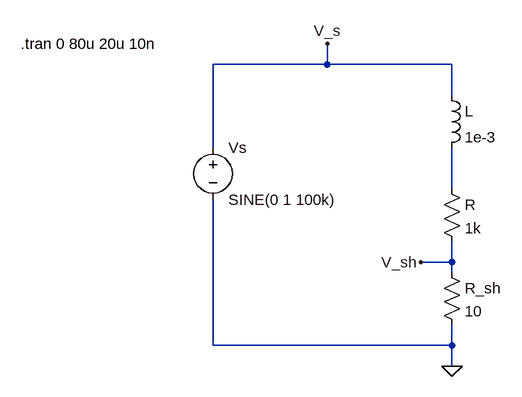
[diagram p0: schematic Simulacao1.asc]
Simulacao1.asc, the LTspice schematic file:
Version 4
SHEET 1 880 680
WIRE -32 -96 -32 -128
WIRE -32 -96 -208 -96
WIRE 160 -96 -32 -96
WIRE 160 -48 160 -96
WIRE -208 32 -208 -96
WIRE 160 96 160 32
WIRE 160 208 160 176
WIRE 160 208 112 208
WIRE 160 224 160 208
WIRE -208 336 -208 112
WIRE 160 336 160 304
WIRE 160 336 -208 336
WIRE 160 368 160 336
FLAG 160 368 0
FLAG 112 208 V_sh
FLAG -32 -128 V_s
SYMBOL voltage -208 16 R0
WINDOW 123 0 0 Left 0
WINDOW 39 0 0 Left 0
SYMATTR InstName Vs
SYMATTR Value SINE(0 1 100k)
SYMBOL res 144 80 R0
SYMATTR InstName R
SYMATTR Value 1k
SYMBOL ind 144 -64 R0
SYMATTR InstName L
SYMATTR Value 1e-3
SYMBOL res 144 208 R0
SYMATTR InstName R_sh
SYMATTR Value 10
TEXT -504 -128 Left 2 !.tran 0 80u 20u 10n

The netlist it stands for:
* Simulacao1.asc
Vs V_s 0 SINE(0 1 100k)
R N001 V_sh 1k
L V_s N001 1e-3
R_sh V_sh 0 10
.tran 0 80u 20u 10n
.backanno
.end

* Results of the author's LTspice run, read from the files saved beside the schematic
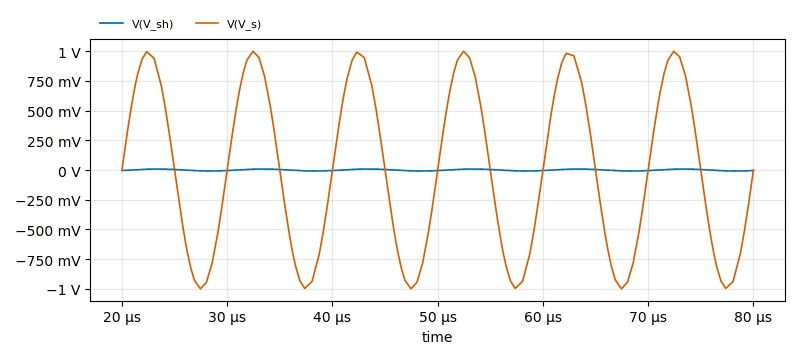
[diagram p1: Transient Analysis of Simulacao1.asc, plotted from the saved traces]
* Transient Analysis, 1 run:
*   V(V_sh): min -8.35 mV, max 8.367 mV, average -731 nV, rms 5.911 mV, last -4.441 mV
*   V(V_s): min -999.6 mV, max 999.6 mV, average -81.42 µV, rms 703.1 mV, last 0 V